# EAGLE schematic PCB Plates Combined Eagle (EAGLE 9.4.2)
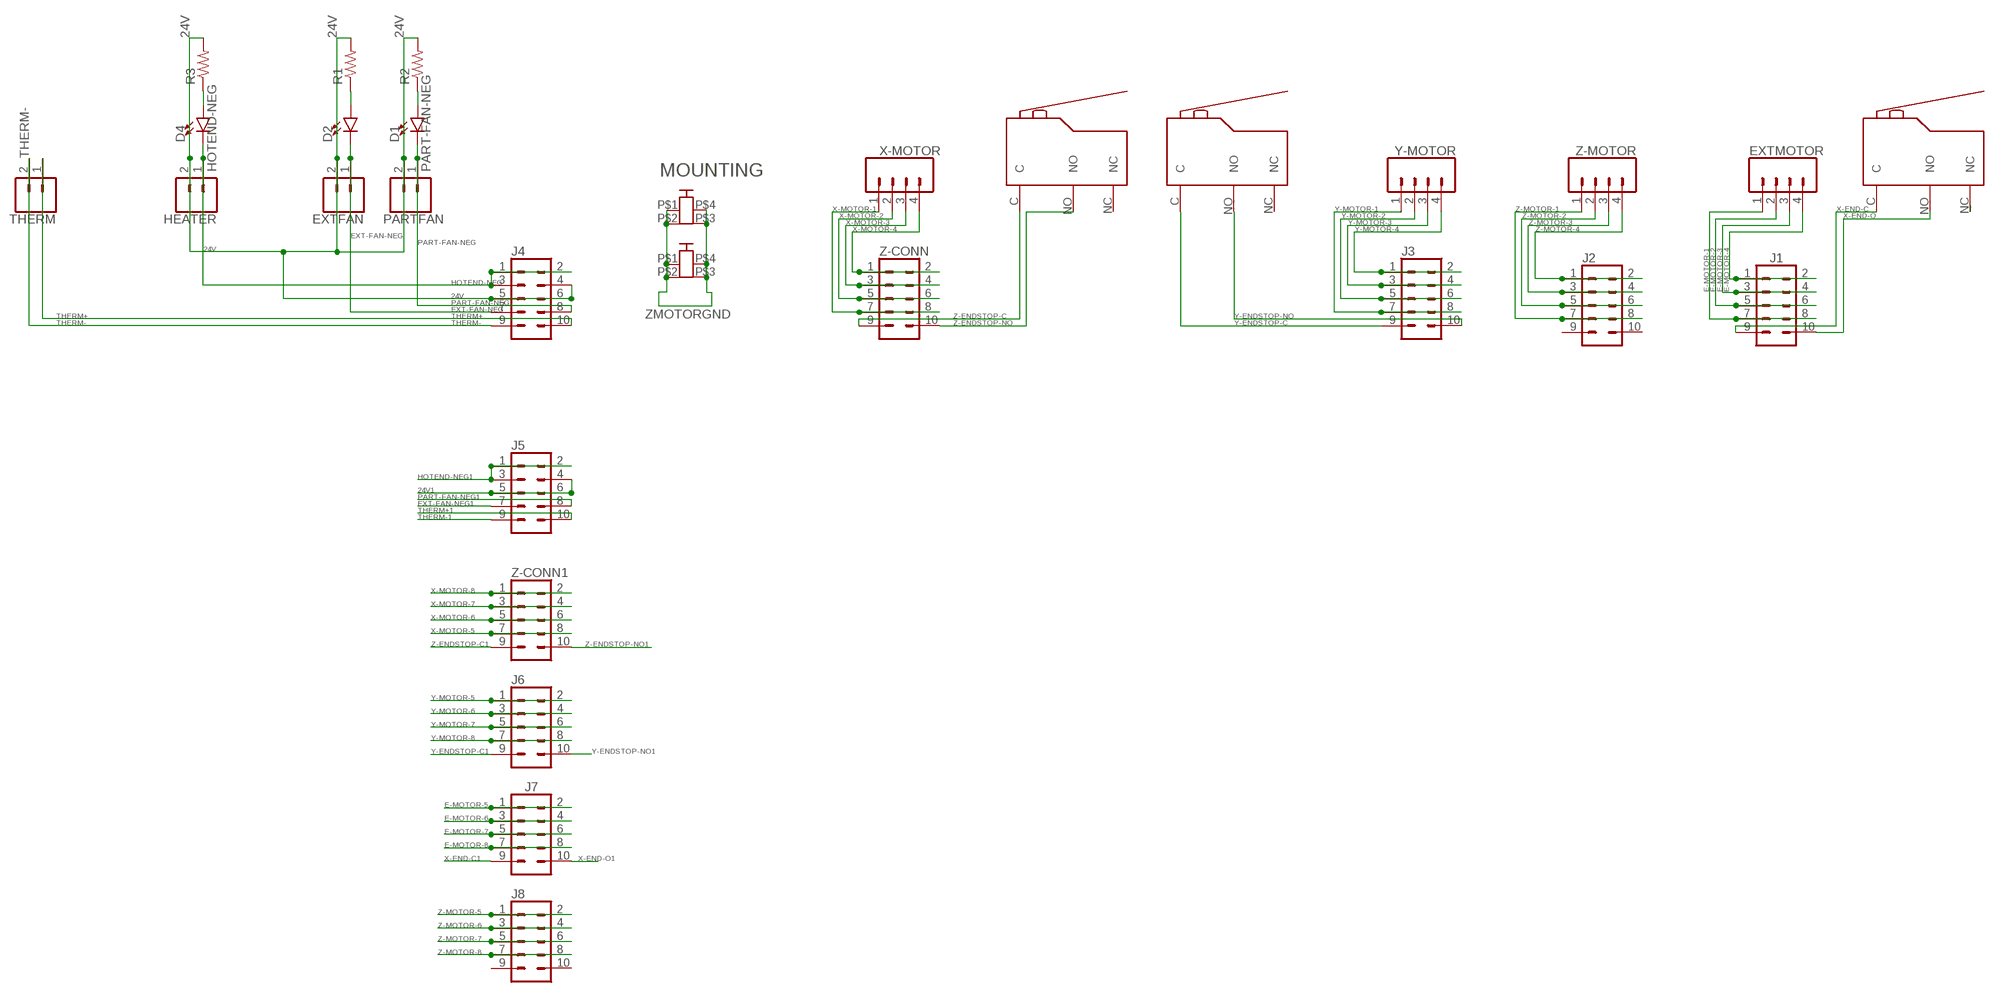
[diagram p0: schematic, sheet 1]

## Parts
CON1  PCB-2M3  [PCB2-M3]
CON7  PCB-2M3  [PCB2-M3]
D1  LED-FKIT-1206  [FKIT-LED-1206]
D2  LED-FKIT-1206  [FKIT-LED-1206]
D4  LED-FKIT-1206  [FKIT-LED-1206]
EXTFAN  CONN_023.5MM_LOCK  [SCREWTERMINAL-3.5MM-2_LOCK]
EXTMOTOR  CONN_04SCREW_LOCK  [SCREWTERMINAL-3.5MM-4_LOCK]
HEATER  CONN_023.5MM_LOCK  [SCREWTERMINAL-3.5MM-2_LOCK]
J1  CONN_05X2SHD_LOCK  [2X5-SHROUDED_LOCK]
J2  CONN_05X2SHD_LOCK  [2X5-SHROUDED_LOCK]
J3  CONN_05X2SHD_LOCK  [2X5-SHROUDED_LOCK]
J4  CONN_05X2SHD_LOCK  [2X5-SHROUDED_LOCK]
J5  CONN_05X2SHD_LOCK  [2X5-SHROUDED_LOCK]
J6  CONN_05X2SHD_LOCK  [2X5-SHROUDED_LOCK]
J7  CONN_05X2SHD_LOCK  [2X5-SHROUDED_LOCK]
J8  CONN_05X2SHD_LOCK  [2X5-SHROUDED_LOCK]
PARTFAN  CONN_023.5MM_LOCK  [SCREWTERMINAL-3.5MM-2_LOCK]
R1  R-US_R1206  [R1206]
R2  R-US_R1206  [R1206]
R3  R-US_R1206  [R1206]
THERM  CONN_023.5MM_LOCK  [SCREWTERMINAL-3.5MM-2_LOCK]
U$1  Lever Microswitch Leftangle PCB mount, with Roller style lever, with a red roller  LEVERMICROPCBLEFTANGLE  [LEVERMICROPCB-LEFTANGLE]
X-MOTOR  CONN_04SCREW_LOCK  [SCREWTERMINAL-3.5MM-4_LOCK]
XENDSTOP  Lever Microswitch Leftangle PCB mount, with Roller style lever, with a red roller  LEVERMICROPCBLEFTANGLE  [LEVERMICROPCB-LEFTANGLE]
Y-MOTOR  CONN_04SCREW_LOCK  [SCREWTERMINAL-3.5MM-4_LOCK]
Z-CONN  CONN_05X2SHD_LOCK  [2X5-SHROUDED_LOCK]
Z-CONN1  CONN_05X2SHD_LOCK  [2X5-SHROUDED_LOCK]
Z-MOTOR  CONN_04SCREW_LOCK  [SCREWTERMINAL-3.5MM-4_LOCK]
ZENDSTOP  Lever Microswitch Leftangle PCB mount, with Roller style lever, with a red roller  LEVERMICROPCBLEFTANGLE  [LEVERMICROPCB-LEFTANGLE]

## Nets
24V: EXTFAN.2 HEATER.2 J4.4 J4.5 J4.6 PARTFAN.2 R1.2 R2.2 R3.2
24V1: J5.4 J5.5 J5.6
E-MOTOR-1: EXTMOTOR.1 J1.7 J1.8
E-MOTOR-2: EXTMOTOR.2 J1.5 J1.6
E-MOTOR-3: EXTMOTOR.3 J1.3 J1.4
E-MOTOR-4: EXTMOTOR.4 J1.1 J1.2
E-MOTOR-5: J7.1 J7.2
E-MOTOR-6: J7.3 J7.4
E-MOTOR-7: J7.5 J7.6
E-MOTOR-8: J7.7 J7.8
EXT-FAN-NEG: D2.C EXTFAN.1 J4.7
EXT-FAN-NEG1: J5.7
HOTEND-NEG: D4.C HEATER.1 J4.1 J4.2 J4.3
HOTEND-NEG1: J5.1 J5.2 J5.3
N$1: XENDSTOP.NC
N$12: D2.A R1.1
N$48: D1.A R2.1
N$49: D4.A R3.1
PART-FAN-NEG: D1.C J4.8 PARTFAN.1
PART-FAN-NEG1: J5.8
THERM+: J4.10 THERM.1
THERM+1: J5.10
THERM-: J4.9 THERM.2
THERM-1: J5.9
X-END-C: J1.9 XENDSTOP.C
X-END-C1: J7.9
X-END-O: J1.10 XENDSTOP.NO
X-END-O1: J7.10
X-MOTOR-1: X-MOTOR.1 Z-CONN.7 Z-CONN.8
X-MOTOR-2: X-MOTOR.2 Z-CONN.5 Z-CONN.6
X-MOTOR-3: X-MOTOR.3 Z-CONN.3 Z-CONN.4
X-MOTOR-4: X-MOTOR.4 Z-CONN.1 Z-CONN.2
X-MOTOR-5: Z-CONN1.7 Z-CONN1.8
X-MOTOR-6: Z-CONN1.5 Z-CONN1.6
X-MOTOR-7: Z-CONN1.3 Z-CONN1.4
X-MOTOR-8: Z-CONN1.1 Z-CONN1.2
Y-ENDSTOP-C: J3.9 U$1.C
Y-ENDSTOP-C1: J6.9
Y-ENDSTOP-NO: J3.10 U$1.NO
Y-ENDSTOP-NO1: J6.10
Y-MOTOR-1: J3.7 J3.8 Y-MOTOR.1
Y-MOTOR-2: J3.5 J3.6 Y-MOTOR.2
Y-MOTOR-3: J3.3 J3.4 Y-MOTOR.3
Y-MOTOR-4: J3.1 J3.2 Y-MOTOR.4
Y-MOTOR-5: J6.1 J6.2
Y-MOTOR-6: J6.3 J6.4
Y-MOTOR-7: J6.5 J6.6
Y-MOTOR-8: J6.7 J6.8
Z-ENDSTOP-C: Z-CONN.9 ZENDSTOP.C
Z-ENDSTOP-C1: Z-CONN1.9
Z-ENDSTOP-NO: Z-CONN.10 ZENDSTOP.NO
Z-ENDSTOP-NO1: Z-CONN1.10
Z-MOTOR-1: J2.7 J2.8 Z-MOTOR.1
Z-MOTOR-2: J2.5 J2.6 Z-MOTOR.2
Z-MOTOR-3: J2.3 J2.4 Z-MOTOR.3
Z-MOTOR-4: J2.1 J2.2 Z-MOTOR.4
Z-MOTOR-5: J8.1 J8.2
Z-MOTOR-6: J8.3 J8.4
Z-MOTOR-7: J8.5 J8.6
Z-MOTOR-8: J8.7 J8.8
ZMOTORGND: CON1.P$1 CON1.P$2 CON1.P$3 CON1.P$4 CON7.P$1 CON7.P$2 CON7.P$3 CON7.P$4
Unconnected: J2.9 J2.10 J8.9 J8.10 U$1.NC ZENDSTOP.NC

## Notes on the sheet
- MOUNTING

## Library data of the parts
CON1 CON7 = Screw Terminals:PCB-2M3
D1 D2 D4 = SparkFun-LED:LED: LED (Generic) Standard schematic elements and footprints for 5mm, 3mm, 1206, and 0603 sized LEDs. Generic LEDs with no color specified.
EXTFAN HEATER PARTFAN THERM = SparkFun-Connectors:CONN_02: Multi connection point. Often used as Generic Header-pin footprint for 0.1 inch spaced/style header connections On any of the 0.1 inch spaced packages, you can populate with these: Break Away Headers - Straight <https://www.sparkfun.com/products/116> (PRT-00116) Break Away Male Headers - Right Angle <https://www.sparkfun.com/products/553> (PRT-00553) Female Headers <https://www.sparkfun.com/products/115> (PRT-00115) Break Away Headers - Machine Pin <https://www.sparkfun.com/products/117> (PRT-00117) Break Away Female Headers - Swiss Machine Pin <https://www.sparkfun.com/products/743> (PRT-00743) For SCREWTERMINALS and SPRING TERMINALS visit here: Screw Terimnals on SparkFun.com <https://www.sparkfun.com/search/results?term=Screw+Terminals> (5mm/3.5mm/2.54mm spacing) This device is also useful as a general connection point to wire up your design to another part of your project. Our various solder wires solder well into these plated through hole pads. Hook-Up Wire - Assortment (Stranded, 22 AWG) <https://www.sparkfun.com/products/11375> (PRT-11375) Hook-Up Wire - Assortment (Solid Core, 22 AWG) <https://www.sparkfun.com/products/11367> (PRT-11367) View the entire wire category on our website here <https://www.sparkfun.com/categories/141> Special notes: Molex polarized connector foot print use with: PRT-08233 with associated crimp pins and housings. 2.54_SCREWTERM for use with PRT-10571. 3.5mm Screw Terminal footprints for PRT-08084 5mm Screw Terminal footprints for use with PRT-08432; PROD_ID: CONN-08399
EXTMOTOR X-MOTOR Y-MOTOR Z-MOTOR = SparkFun-Connectors:CONN_04: Multi connection point. Often used as Generic Header-pin footprint for 0.1 inch spaced/style header connections On any of the 0.1 inch spaced packages, you can populate with these: Break Away Headers - Straight <https://www.sparkfun.com/products/116> (PRT-00116) Break Away Male Headers - Right Angle <https://www.sparkfun.com/products/553> (PRT-00553) Female Headers <https://www.sparkfun.com/products/115> (PRT-00115) Break Away Headers - Machine Pin <https://www.sparkfun.com/products/117> (PRT-00117) Break Away Female Headers - Swiss Machine Pin <https://www.sparkfun.com/products/743> (PRT-00743) For SCREWTERMINALS and SPRING TERMINALS visit here: Screw Terimnals on SparkFun.com <https://www.sparkfun.com/search/results?term=Screw+Terminals> (5mm/3.5mm/2.54mm spacing) This device is also useful as a general connection point to wire up your design to another part of your project. Our various solder wires solder well into these plated through hole pads. Hook-Up Wire - Assortment (Stranded, 22 AWG) <https://www.sparkfun.com/products/11375> (PRT-11375) Hook-Up Wire - Assortment (Solid Core, 22 AWG) <https://www.sparkfun.com/products/11367> (PRT-11367) View the entire wire category on our website here <https://www.sparkfun.com/categories/141> Special notes: Molex polarized connector foot print use with SKU : PRT-08231 with associated crimp pins and housings. 1MM SMD Version SKU: PRT-10208
J1-J8 Z-CONN Z-CONN1 = SparkFun-Connectors:CONN_05X2: Multi connection point. Often used as Generic Header-pin footprint for 0.1 inch spaced/style header connections For AVR SPI programming port, see special device with nice symbol: "AVR_SPI_PROG_5x2.dev" You can populate with any combo of single row headers, but if you'd like an exact match, check these: 2x5 AVR ICSP Male Header <https://www.sparkfun.com/products/778> (PRT-00778) 2x5 Pin Shrouded Header <https://www.sparkfun.com/products/8506> (PRT-08506) On any of the 0.1 inch spaced packages, you can populate with these: Break Away Headers - Straight <https://www.sparkfun.com/products/116> (PRT-00116) Break Away Male Headers - Right Angle <https://www.sparkfun.com/products/553> (PRT-00553) Female Headers <https://www.sparkfun.com/products/115> (PRT-00115) Break Away Headers - Machine Pin <https://www.sparkfun.com/products/117> (PRT-00117) Break Away Female Headers - Swiss Machine Pin <https://www.sparkfun.com/products/743> (PRT-00743) Special note: the shrouded connector mates well with our 5x2 ribbon cables: 2x5 Pin IDC Ribbon Cable <https://www.sparkfun.com/products/8535> (PRT-08535); PROD_ID: CONN-08671; SF_ID: PRT-08506
R1-R3 = rcl:R-US_: RESISTOR, American symbol; SPICEPREFIX: R
U$1 XENDSTOP ZENDSTOP = Lever Microswitch Right Angle:LEVERMICROPCB

## Net classes
0 default: width 0.203 mm, clearance 0.152 mm